# Altium schematic sheet config-bank2.SchDoc: Config FPGA - Bank 2
size Legal; CheckedBy: J. Brinton; CompanyName: Signal Laboratories, Inc.; DrawnBy: J. Brinton; Engineer: J. Brinton; Address1: 3479 Edison Way; Address2: Menlo Park CA 94025; Address3: +1 (877) 778-8435; Address4: siglabs.com; DocumentNumber: 14; Revision: 2b; SheetNumber: 15; SheetTotal: 58
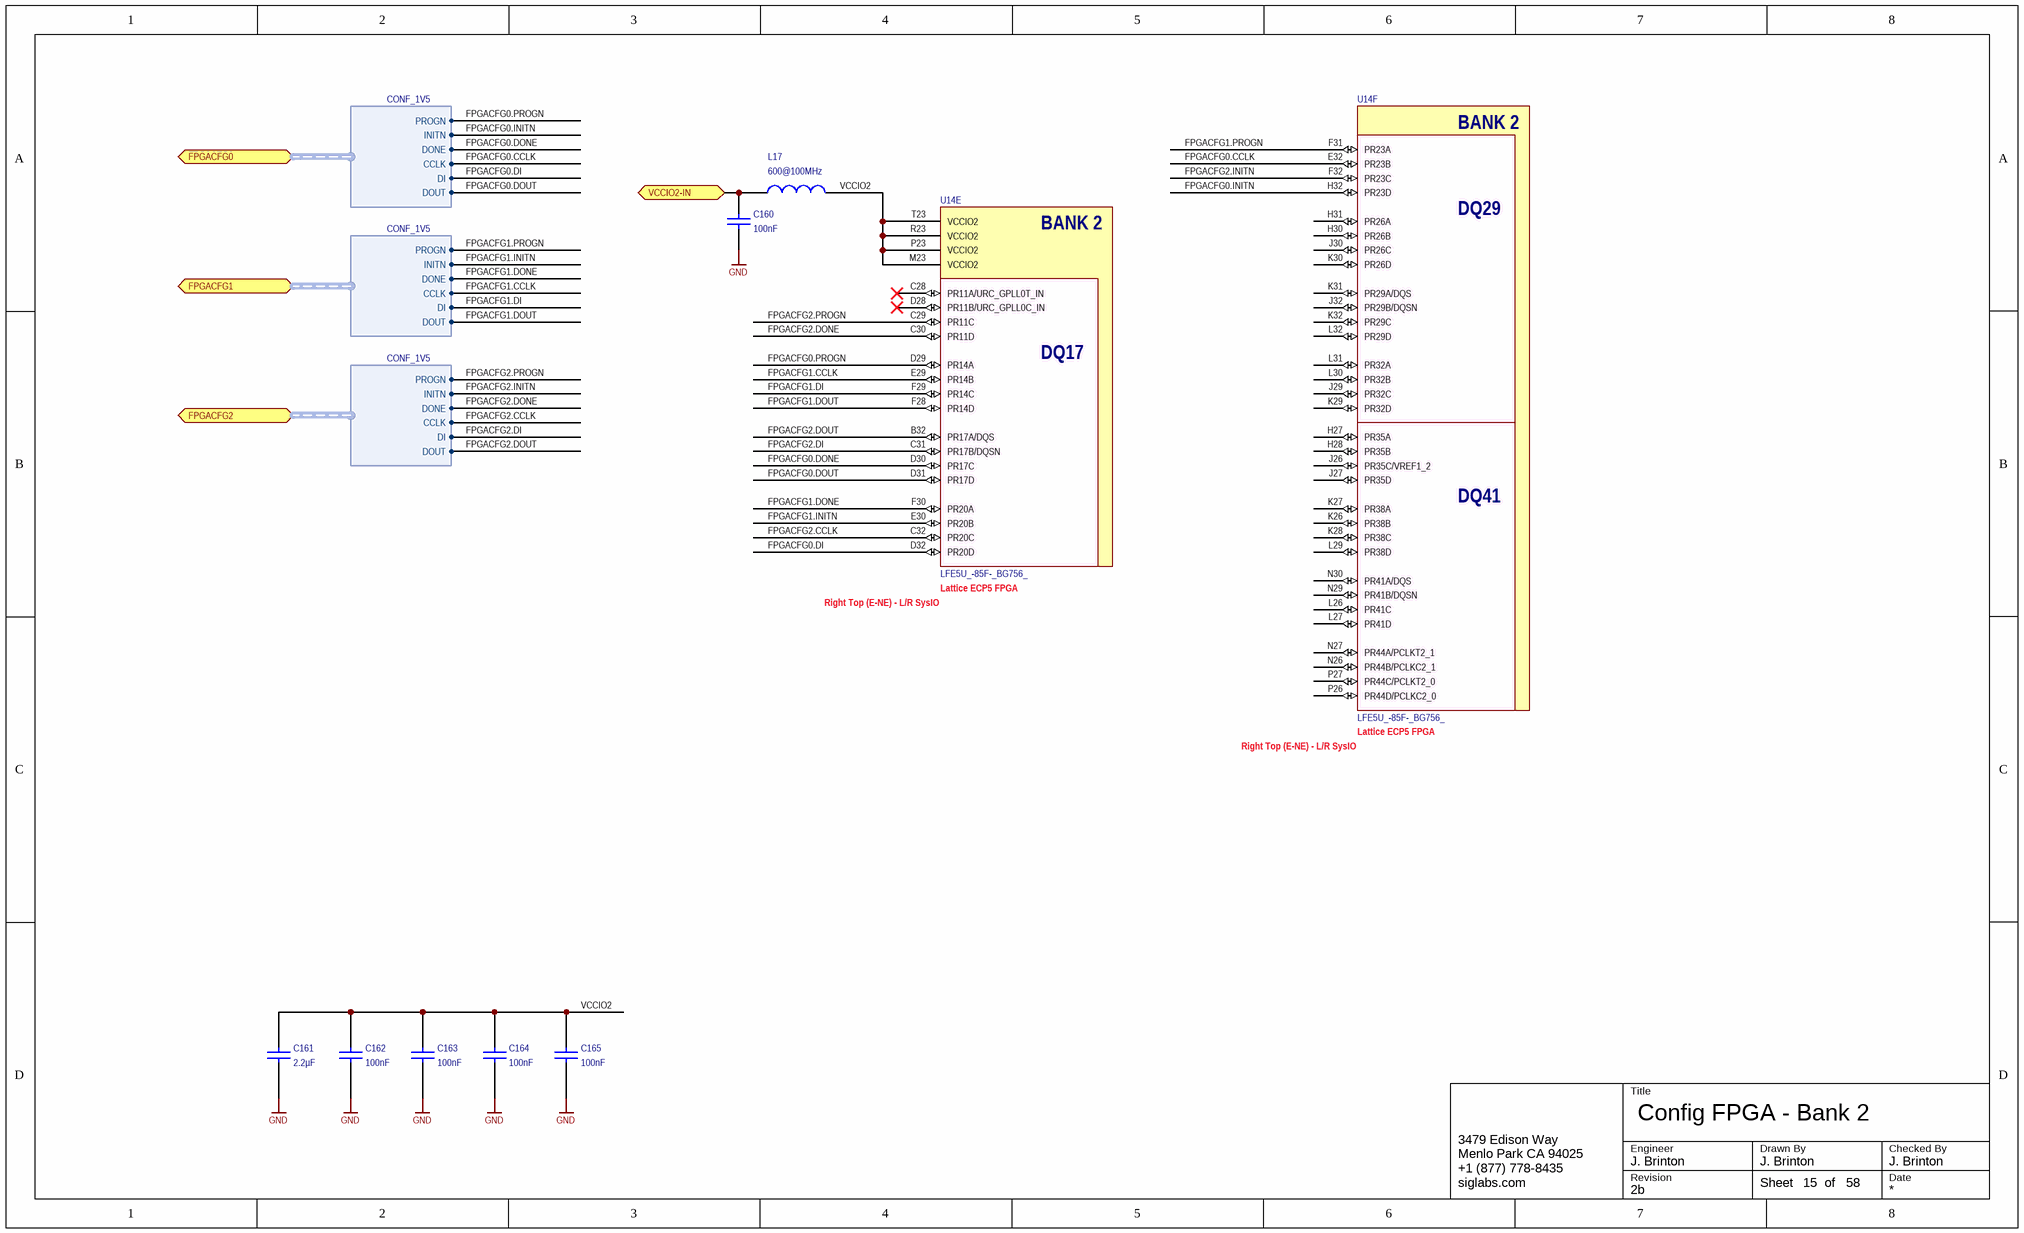
[diagram p0: config-bank2.SchDoc]

## Parts
C160  value 100nF  [CAPC1005X56N]  (hidden comment: GRM155R71C104KA88J)
C161  value 2.2µF  [CAPC1608X90N]  (hidden comment: GRM21BR71C225KA12L)
C162  value 100nF  [CAPC1005X56N]  (hidden comment: GRM155R71C104KA88J)
C163  value 100nF  [CAPC1005X56N]  (hidden comment: GRM155R71C104KA88J)
C164  value 100nF  [CAPC1005X56N]  (hidden comment: GRM155R71C104KA88J)
C165  value 100nF  [CAPC1005X56N]  (hidden comment: GRM155R71C104KA88J)
L17  value 600@100MHz  [0402]  (hidden comment: BLM15PX601SN1D)
U14  LFE5U_-85F-_BG756_  [caBGA756]  (parts E,F of 19)

## Ports
FPGACFG0 (harness CONF_1V5), FPGACFG1 (harness CONF_1V5), FPGACFG2 (harness CONF_1V5), VCCIO2-IN

## Harnesses
CONF_1V5: PROGN, INITN, DONE, CCLK, DI, DOUT

## Nets
GND: C160.1 C161.1 C162.1 C163.1 C164.1 C165.1
FPGACFG0.CCLK: U14.E32(PR23B) ; port FPGACFG0.CCLK
FPGACFG0.DI: U14.D32(PR20D) ; port FPGACFG0.DI
FPGACFG0.DONE: U14.D30(PR17C) ; port FPGACFG0.DONE
FPGACFG0.DOUT: U14.D31(PR17D) ; port FPGACFG0.DOUT
FPGACFG0.INITN: U14.H32(PR23D) ; port FPGACFG0.INITN
FPGACFG0.PROGN: U14.D29(PR14A) ; port FPGACFG0.PROGN
FPGACFG1.CCLK: U14.E29(PR14B) ; port FPGACFG1.CCLK
FPGACFG1.DI: U14.F29(PR14C) ; port FPGACFG1.DI
FPGACFG1.DONE: U14.F30(PR20A) ; port FPGACFG1.DONE
FPGACFG1.DOUT: U14.F28(PR14D) ; port FPGACFG1.DOUT
FPGACFG1.INITN: U14.E30(PR20B) ; port FPGACFG1.INITN
FPGACFG1.PROGN: U14.F31(PR23A) ; port FPGACFG1.PROGN
FPGACFG2.CCLK: U14.C32(PR20C) ; port FPGACFG2.CCLK
FPGACFG2.DI: U14.C31(PR17B/DQSN) ; port FPGACFG2.DI
FPGACFG2.DONE: U14.C30(PR11D) ; port FPGACFG2.DONE
FPGACFG2.DOUT: U14.B32(PR17A/DQS) ; port FPGACFG2.DOUT
FPGACFG2.INITN: U14.F32(PR23C) ; port FPGACFG2.INITN
FPGACFG2.PROGN: U14.C29(PR11C) ; port FPGACFG2.PROGN
VCCIO2: C161.2 C162.2 C163.2 C164.2 C165.2 L17.1 U14.M23(VCCIO2) U14.P23(VCCIO2) U14.R23(VCCIO2) U14.T23(VCCIO2)
VCCIO2-IN: C160.2 L17.2 ; port VCCIO2-IN

Not connected (* = marked no-connect by the designer): U14 C28(PR11A/URC_GPLL0T_IN)* D28(PR11B/URC_GPLL0C_IN)* H27(PR35A) H28(PR35B) H30(PR26B) H31(PR26A) J26(PR35C/VREF1_2) J27(PR35D) J29(PR32C) J30(PR26C) J32(PR29B/DQSN) K26(PR38B) K27(PR38A) K28(PR38C) K29(PR32D) K30(PR26D) K31(PR29A/DQS) K32(PR29C) L26(PR41C) L27(PR41D) L29(PR38D) L30(PR32B) L31(PR32A) L32(PR29D) N26(PR44B/PCLKC2_1) N27(PR44A/PCLKT2_1) N29(PR41B/DQSN) N30(PR41A/DQS) P26(PR44D/PCLKC2_0) P27(PR44C/PCLKT2_0)

## Notes on the sheet
- (near U14) Right Top (E-NE) - L/R SysIO
- (near U14) Lattice ECP5 FPGA
- Title
- Engineer
- Revision
- Drawn By
- Checked By
- Date
- Sheet
- of
- (in symbol LFE5U_-85F-_BG756_, part E) BANK 2; DQ17
- (in symbol LFE5U_-85F-_BG756_, part F) BANK 2; DQ29; DQ41

## Library data of the parts
C160 C162-C165 = GRM155R71A104KA01J: Ceramic Capacitor 100nF ±10% 16V X7R 0402; Manufacturer: Murata; Tr: -55:125; Manufacturer P/N: GRM155R71C104KA88J; Tolerance: ±10%; Package: 0402; Voltage: 16V
C161 = GRM188R71A225KE15D: Ceramic Capacitor 2.2uF ±10% 10V X7R 0603; Manufacturer: Murata; Tr: -55:125; Manufacturer P/N: GRM188R71A225KE15D; Tolerance: ±10%; Package: 0603; Voltage: 10V
L17 = IND 0402: Ferrite Bead 600-Ohm @ 100MHz 900mA 0402; Manufacturer: Murata; Tolerance: ±25%; Tr: -55:125; Manufacturer P/N: BLM15PX601SN1D; Package: 0402
U14 = LFE5U_-85F-_BG756_: ECP5 FPGA, 85k LUT, 756-caBGA; Manufacturer: Lattice Semiconductor; Manufacturer P/N: LFE5U_-85F-_BG756_